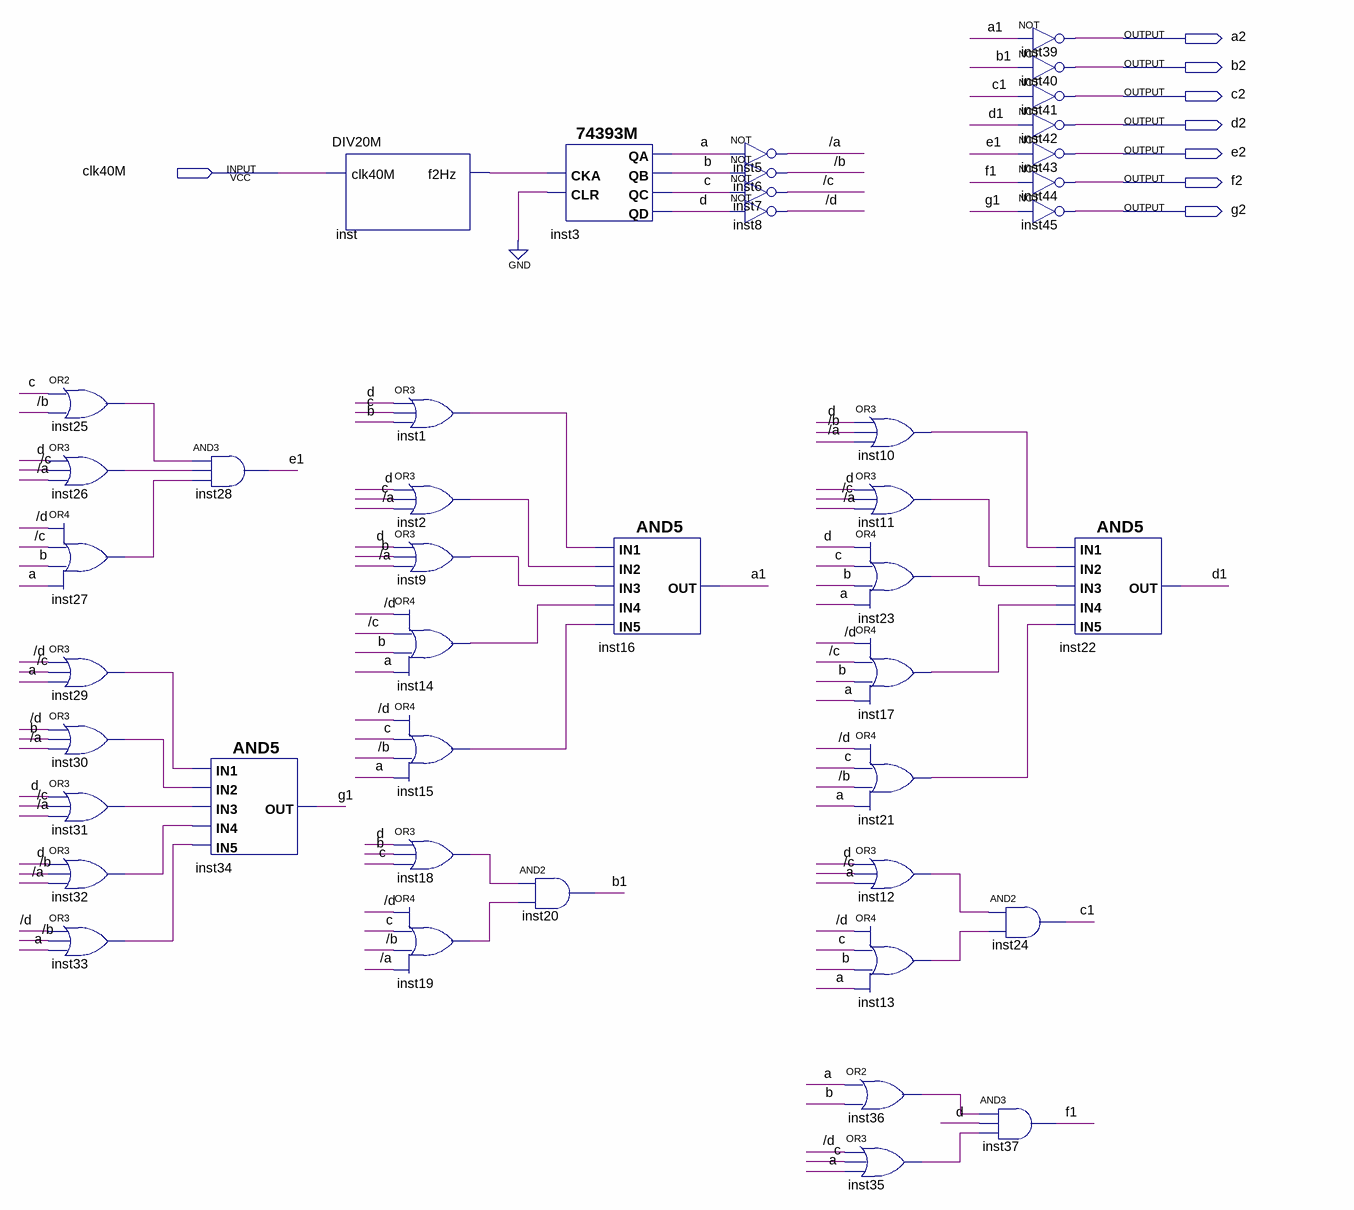
[diagram p0: schematic sheet]
// Quartus schematic no312127.bdf as structural Verilog: 44 symbols, 8 pins
module no312127 (
  input  clk40M,
  output a2,
  output b2,
  output c2,
  output d2,
  output e2,
  output f2,
  output g2
);

  wire \/a , \/b , \/c , \/d , a, a1, b, b1, c, c1, d, d1, e1, f1, g1, inst1_out, inst2_out, inst9_out,
       inst10_out, inst11_out, inst12_out, inst13_out, inst14_out, inst15_out, inst17_out, inst18_out,
       inst19_out, inst21_out, inst23_out, inst25_out, inst26_out, inst27_out, inst29_out, inst30_out,
       inst31_out, inst32_out, inst33_out, inst35_out, inst36_out, inst_f2hz;

  or inst25 (inst25_out, c, \/b );
  or inst26 (inst26_out, d, \/c , \/a );
  or inst27 (inst27_out, \/d , \/c , b, a);
  or inst29 (inst29_out, \/d , \/c , a);
  or inst30 (inst30_out, \/d , b, \/a );
  or inst31 (inst31_out, d, \/c , \/a );
  or inst32 (inst32_out, d, \/b , \/a );
  or inst33 (inst33_out, \/d , \/b , a);
  and inst28 (e1, inst25_out, inst26_out, inst27_out);
  and inst34 (g1, inst29_out, inst30_out, inst31_out, inst32_out, inst33_out);
  DIV20M inst (.clk40M(clk40M), .f2Hz(inst_f2hz));
  or inst1 (inst1_out, d, c, b);
  or inst2 (inst2_out, d, c, \/a );
  or inst9 (inst9_out, d, b, \/a );
  or inst14 (inst14_out, \/d , \/c , b, a);
  or inst15 (inst15_out, \/d , c, \/b , a);
  or inst18 (inst18_out, d, b, c);
  or inst19 (inst19_out, \/d , c, \/b , \/a );
  \74393M  inst3 (.CLR(1'b0), .CKA(inst_f2hz), .QC(c), .QD(d), .QB(b), .QA(a));
  and inst20 (b1, inst18_out, inst19_out);
  and inst16 (a1, inst1_out, inst2_out, inst9_out, inst14_out, inst15_out);
  not inst5 (\/a , a);
  not inst6 (\/b , b);
  not inst7 (\/c , c);
  not inst8 (\/d , d);
  or inst10 (inst10_out, d, \/b , \/a );
  or inst11 (inst11_out, d, \/c , \/a );
  or inst23 (inst23_out, d, c, b, a);
  or inst17 (inst17_out, \/d , \/c , b, a);
  or inst21 (inst21_out, \/d , c, \/b , a);
  or inst12 (inst12_out, d, \/c , a);
  or inst13 (inst13_out, \/d , c, b, a);
  or inst36 (inst36_out, a, b);
  or inst35 (inst35_out, \/d , c, a);
  and inst24 (c1, inst12_out, inst13_out);
  and inst37 (f1, inst36_out, d, inst35_out);
  not inst39 (a2, a1);
  not inst40 (b2, b1);
  not inst41 (c2, c1);
  not inst42 (d2, d1);
  not inst43 (e2, e1);
  not inst44 (f2, f1);
  not inst45 (g2, g1);
  and inst22 (d1, inst10_out, inst11_out, inst23_out, inst17_out, inst21_out);
endmodule
